# EAGLE design audio_mixer (EAGLE 9.3.0)
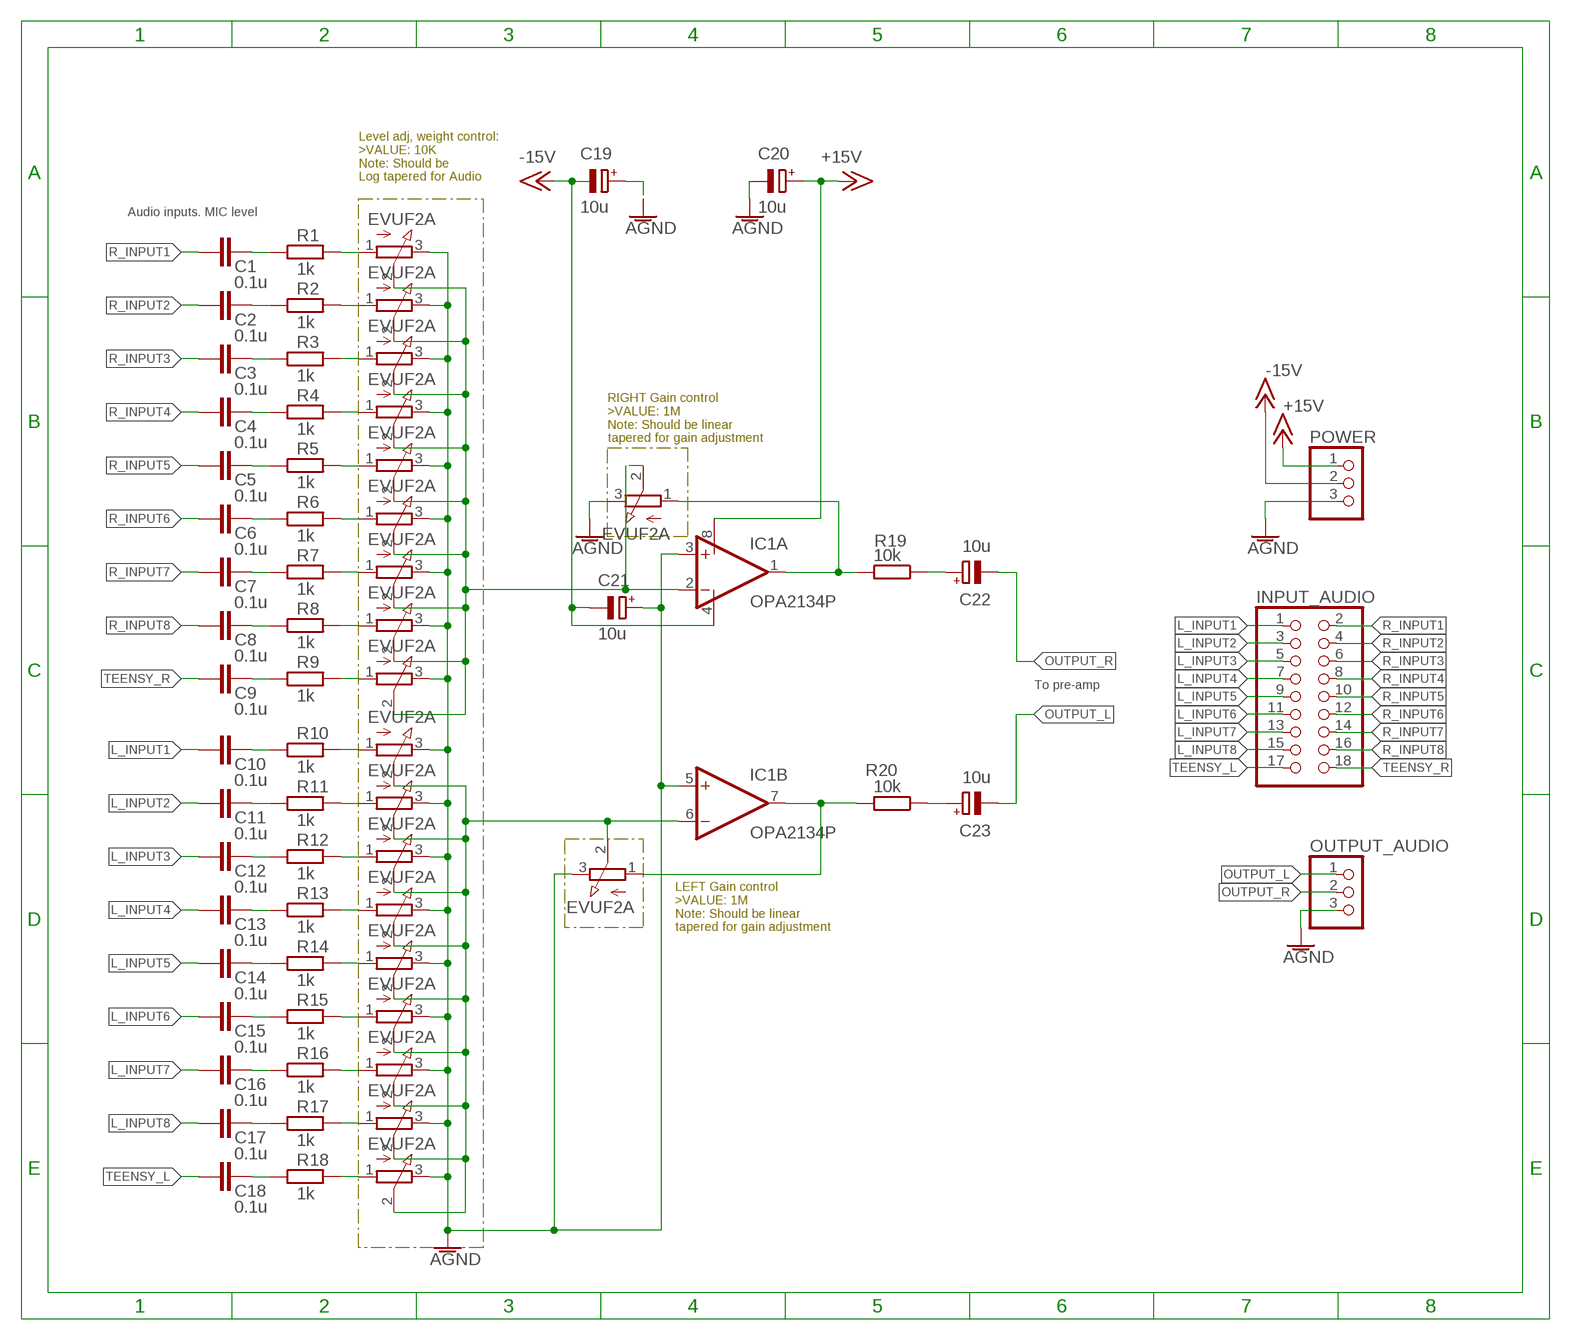
[diagram p0: schematic, sheet 1]

## Parts
C1  0.1u  C-EU025-030X050  [C025-030X050]
C2  0.1u  C-EU025-030X050  [C025-030X050]
C3  0.1u  C-EU025-030X050  [C025-030X050]
C4  0.1u  C-EU025-030X050  [C025-030X050]
C5  0.1u  C-EU025-030X050  [C025-030X050]
C6  0.1u  C-EU025-030X050  [C025-030X050]
C7  0.1u  C-EU025-030X050  [C025-030X050]
C8  0.1u  C-EU025-030X050  [C025-030X050]
C9  0.1u  C-EU025-030X050  [C025-030X050]
C10  0.1u  C-EU025-030X050  [C025-030X050]
C11  0.1u  C-EU025-030X050  [C025-030X050]
C12  0.1u  C-EU025-030X050  [C025-030X050]
C13  0.1u  C-EU025-030X050  [C025-030X050]
C14  0.1u  C-EU025-030X050  [C025-030X050]
C15  0.1u  C-EU025-030X050  [C025-030X050]
C16  0.1u  C-EU025-030X050  [C025-030X050]
C17  0.1u  C-EU025-030X050  [C025-030X050]
C18  0.1u  C-EU025-030X050  [C025-030X050]
C19  10u  CPOL-EUE5-10.5  [E5-10,5]
C20  10u  CPOL-EUE5-10.5  [E5-10,5]
C21  10u  CPOL-EUE5-10.5  [E5-10,5]
C22  10u  CPOL-EUE5-10.5  [E5-10,5]
C23  10u  CPOL-EUE5-10.5  [E5-10,5]
IC1  OPA2134P  [DIL08]
INPUT_AUDIO  PINHD-2X9  [2X09]
OUTPUT_AUDIO  PINHD-1X3  [1X03]
POWER  PINHD-1X3  [1X03]
R1  1k  R-EU_R0805  [R0805]
R2  1k  R-EU_R0805  [R0805]
R3  1k  R-EU_R0805  [R0805]
R4  1k  R-EU_R0805  [R0805]
R5  1k  R-EU_R0805  [R0805]
R6  1k  R-EU_R0805  [R0805]
R7  1k  R-EU_R0805  [R0805]
R8  1k  R-EU_R0805  [R0805]
R9  1k  R-EU_R0805  [R0805]
R10  1k  R-EU_R0805  [R0805]
R11  1k  R-EU_R0805  [R0805]
R12  1k  R-EU_R0805  [R0805]
R13  1k  R-EU_R0805  [R0805]
R14  1k  R-EU_R0805  [R0805]
R15  1k  R-EU_R0805  [R0805]
R16  1k  R-EU_R0805  [R0805]
R17  1k  R-EU_R0805  [R0805]
R18  1k  R-EU_R0805  [R0805]
R19  10k  R-EU_R0805  [R0805]
R20  10k  R-EU_R0805  [R0805]
VR1  EVUF2A  [EVUF]
VR2  EVUF2A  [EVUF]
VR3  EVUF2A  [EVUF]
VR4  EVUF2A  [EVUF]
VR5  EVUF2A  [EVUF]
VR6  EVUF2A  [EVUF]
VR7  EVUF2A  [EVUF]
VR8  EVUF2A  [EVUF]
VR9  EVUF2A  [EVUF]
VR10  EVUF2A  [EVUF]
VR11  EVUF2A  [EVUF]
VR12  EVUF2A  [EVUF]
VR13  EVUF2A  [EVUF]
VR14  EVUF2A  [EVUF]
VR15  EVUF2A  [EVUF]
VR16  EVUF2A  [EVUF]
VR17  EVUF2A  [EVUF]
VR18  EVUF2A  [EVUF]
VR19  EVUF2A  [EVUF]
VR20  EVUF2A  [EVUF]

## Nets
+15V: C20.+ IC1.8(P:V+) POWER.1
-15V: C19.- C21.- IC1.4(P:V-) POWER.2
AGND: C19.+ C20.- C21.+ IC1.3(A:+IN) IC1.5(B:+IN) OUTPUT_AUDIO.3 POWER.3 VR1.3(E) VR2.3(E) VR3.3(E) VR4.3(E) VR5.3(E) VR6.3(E) VR7.3(E) VR8.3(E) VR9.3(E) VR10.3(E) VR11.3(E) VR12.3(E) VR13.3(E) VR14.3(E) VR15.3(E) VR16.3(E) VR17.3(E) VR18.3(E) VR19.3(E) VR20.3(E)
L_INPUT1: C10.2 INPUT_AUDIO.1
L_INPUT2: C11.2 INPUT_AUDIO.3
L_INPUT3: C12.2 INPUT_AUDIO.5
L_INPUT4: C13.2 INPUT_AUDIO.7
L_INPUT5: C14.2 INPUT_AUDIO.9
L_INPUT6: C15.2 INPUT_AUDIO.11
L_INPUT7: C16.2 INPUT_AUDIO.13
L_INPUT8: C17.2 INPUT_AUDIO.15
L_OP_IN: IC1.6(B:-IN) VR10.2(S) VR11.2(S) VR12.2(S) VR13.2(S) VR14.2(S) VR15.2(S) VR16.2(S) VR17.2(S) VR18.2(S) VR20.2(S)
LEFT_OP_OUT: IC1.7(B:OUT) R20.2 VR20.1(A)
N$1: C4.1 R4.1
N$2: C22.+ R19.1
N$3: C1.1 R1.1
N$4: C2.1 R2.1
N$5: C3.1 R3.1
N$6: C9.1 R9.1
N$7: R9.2 VR9.1(A)
N$8: C10.1 R10.1
N$9: R10.2 VR10.1(A)
N$10: R3.2 VR3.1(A)
N$11: C11.1 R11.1
N$13: R1.2 VR1.1(A)
N$14: R4.2 VR4.1(A)
N$15: C12.1 R12.1
N$16: C13.1 R13.1
N$17: R13.2 VR13.1(A)
N$18: R2.2 VR2.1(A)
N$20: C23.+ R20.1
N$21: R11.2 VR11.1(A)
N$23: R12.2 VR12.1(A)
N$25: C5.1 R5.1
N$26: C6.1 R6.1
N$27: C7.1 R7.1
N$28: R7.2 VR7.1(A)
N$29: R5.2 VR5.1(A)
N$30: R6.2 VR6.1(A)
N$31: C8.1 R8.1
N$32: R8.2 VR8.1(A)
N$35: C14.1 R14.1
N$36: R14.2 VR14.1(A)
N$39: C15.1 R15.1
N$40: C16.1 R16.1
N$41: C17.1 R17.1
N$42: R17.2 VR17.1(A)
N$43: R15.2 VR15.1(A)
N$44: R16.2 VR16.1(A)
N$45: C18.1 R18.1
N$46: R18.2 VR18.1(A)
OUTPUT_L: C23.- OUTPUT_AUDIO.1
OUTPUT_R: C22.- OUTPUT_AUDIO.2
R_INPUT1: C1.2 INPUT_AUDIO.2
R_INPUT2: C2.2 INPUT_AUDIO.4
R_INPUT3: C3.2 INPUT_AUDIO.6
R_INPUT4: C4.2 INPUT_AUDIO.8
R_INPUT5: C5.2 INPUT_AUDIO.10
R_INPUT6: C6.2 INPUT_AUDIO.12
R_INPUT7: C7.2 INPUT_AUDIO.14
R_INPUT8: C8.2 INPUT_AUDIO.16
R_OP_IN: IC1.2(A:-IN) VR1.2(S) VR2.2(S) VR3.2(S) VR4.2(S) VR5.2(S) VR6.2(S) VR7.2(S) VR8.2(S) VR9.2(S) VR19.2(S)
RIGHT_OP_OUT: IC1.1(A:OUT) R19.2 VR19.1(A)
TEENSY_L: C18.2 INPUT_AUDIO.17
TEENSY_R: C9.2 INPUT_AUDIO.18

## Notes on the sheet
- Level adj, weight control:
  >VALUE: 10K
  Note: Should be
  Log tapered for Audio
- Audio inputs. MIC level
- RIGHT Gain control
  >VALUE: 1M
  Note: Should be linear
  tapered for gain adjustment
- To pre-amp
- LEFT Gain control
  >VALUE: 1M
  Note: Should be linear
  tapered for gain adjustment

## Library data of the parts
C1-C18 = rcl:C-EU: CAPACITOR, European symbol; SPICEPREFIX: C
C19-C23 = rcl:CPOL-EU: POLARIZED CAPACITOR, European symbol; SPICEPREFIX: C
IC1 = linear:OPA2134: SoundPLUS (TM) High Performance AUDIO OPERATIONAL AMPLIFIERS Source: http://focus.ti.com/lit/ds/sbos058/sbos058.pdf
INPUT_AUDIO = pinhead:PINHD-2X9: PIN HEADER
OUTPUT_AUDIO POWER = pinhead:PINHD-1X3: PIN HEADER
R1-R20 = rcl:R-EU_: RESISTOR, European symbol; SPICEPREFIX: R
VR1-VR20 = pot:EVU: 9 mm Square Rotary Potentiometers Source: Panasonic

## Board
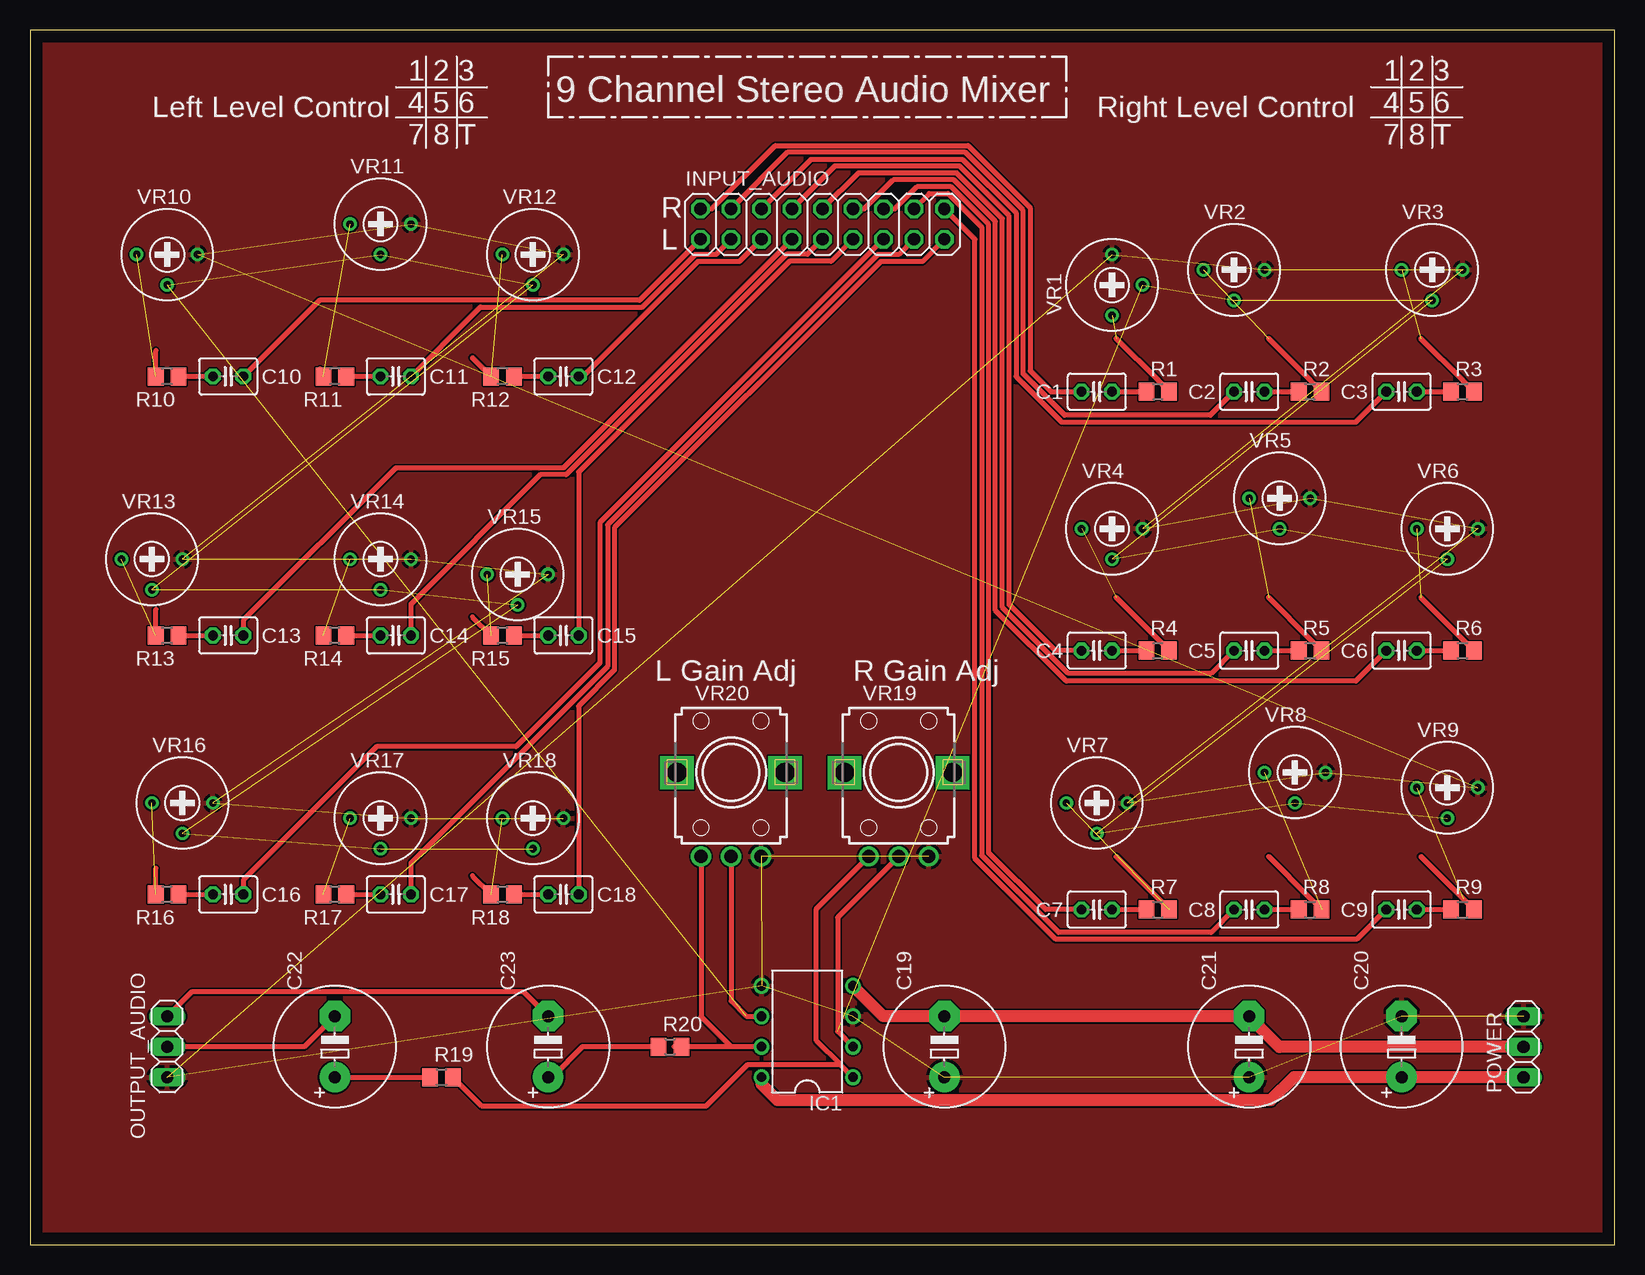
[diagram p1: board, top side]

Size 132.06 x 101.27 mm. Coordinates in mm from the lower left corner, seen from the top.
Outline: 0,0 132.06,0 132.06,101.27 0,101.27 0,0
Copper layers (1*16): Top 0.035mm / dielectric 1.5mm / Bottom 0.035mm
Design rules "default": minimum track width 6mil, minimum drill 0.35mm, track to track 6mil, track to pad 6mil, pad to pad 6mil, via to via 6mil, smd to smd 6mil, copper to edge 40mil, drill to drill 6mil, minimum pad ring 10mil, minimum via ring 8mil, stop-mask expansion 4mil, vias tented up to drill 0mil, thermal gap 10mil

### Footprints (pad centres in the part's own frame; a part is rotated, then mirrored left to right if it is on the bottom)
C025-030X050 = drill 0.813 octagon: 1 -1.27,0; 2 1.27,0
E5-10,5 = drill 1.016 pad 2.54: + -2.54,0 | drill 1.016 pad 2.54 octagon: - 2.54,0
DIL08 = drill 0.813 pad 1.27: 1 -3.81,-3.81; 2 -1.27,-3.81; 3 1.27,-3.81; 4 3.81,-3.81; 5 3.81,3.81; 6 1.27,3.81; 7 -1.27,3.81; 8 -3.81,3.81
2X09 = drill 1.016 octagon: 1 -10.16,-1.27; 2 -10.16,1.27; 3 -7.62,-1.27; 4 -7.62,1.27; 5 -5.08,-1.27; 6 -5.08,1.27; 7 -2.54,-1.27; 8 -2.54,1.27; 9 0,-1.27; 10 0,1.27; 11 2.54,-1.27; 12 2.54,1.27; 13 5.08,-1.27; 14 5.08,1.27; 15 7.62,-1.27; 16 7.62,1.27; 17 10.16,-1.27; 18 10.16,1.27
1X03 = drill 1.016 long: 1 -2.54,0; 2 0,0; 3 2.54,0
R0805 = smd 1.3 x 1.5: 1 -0.95,0; 2 0.95,0
RTRIM3339P = drill 0.61: 1 -2.54,0; 2 0,-2.54; 3 2.54,0
EVUF = drill 1.1 pad 1.676: 1 -2.5,-7; 2 0,-7; 3 2.5,-7 | drill 1.6 pad 2.8 square: M1 4.5,0; M2 -4.5,0

### Placement (x,y rotation side)
C1  88.9,71.12 180 top
C2  101.6,71.12 180 top
C3  114.3,71.12 180 top
C4  88.9,49.53 180 top
C5  101.6,49.53 180 top
C6  114.3,49.53 180 top
C7  88.9,27.94 180 top
C8  101.6,27.94 180 top
C9  114.3,27.94 180 top
C10  16.51,72.39 0 top
C11  30.48,72.39 0 top
C12  44.45,72.39 0 top
C13  16.51,50.8 0 top
C14  30.48,50.8 0 top
C15  44.45,50.8 0 top
C16  16.51,29.21 0 top
C17  30.48,29.21 0 top
C18  44.45,29.21 0 top
C19  76.2,16.51 90 top
C20  114.3,16.51 90 top
C21  101.6,16.51 90 top
C22  25.4,16.51 90 top
C23  43.18,16.51 90 top
IC1  64.77,17.78 90 top
INPUT_AUDIO  66.04,85.09 0 top
OUTPUT_AUDIO  11.43,16.51 270 top
POWER  124.46,16.51 90 top
R1  93.98,71.12 0 top
R2  106.68,71.12 0 top
R3  119.38,71.12 0 top
R4  93.98,49.53 0 top
R5  106.68,49.53 0 top
R6  119.38,49.53 0 top
R7  93.98,27.94 0 top
R8  106.68,27.94 0 top
R9  119.38,27.94 0 top
R10  11.43,72.39 180 top
R11  25.4,72.39 180 top
R12  39.37,72.39 180 top
R13  11.43,50.8 180 top
R14  25.4,50.8 180 top
R15  39.37,50.8 180 top
R16  11.43,29.21 180 top
R17  25.4,29.21 180 top
R18  39.37,29.21 180 top
R19  34.29,13.97 0 top
R20  53.34,16.51 0 top
VR1  [RTRIM3339P]  90.17,80.01 90 top
VR2  [RTRIM3339P]  100.33,81.28 0 top
VR3  [RTRIM3339P]  116.84,81.28 0 top
VR4  [RTRIM3339P]  90.17,59.69 0 top
VR5  [RTRIM3339P]  104.14,62.23 0 top
VR6  [RTRIM3339P]  118.11,59.69 0 top
VR7  [RTRIM3339P]  88.9,36.83 0 top
VR8  [RTRIM3339P]  105.41,39.37 0 top
VR9  [RTRIM3339P]  118.11,38.1 0 top
VR10  [RTRIM3339P]  11.43,82.55 0 top
VR11  [RTRIM3339P]  29.21,85.09 0 top
VR12  [RTRIM3339P]  41.91,82.55 0 top
VR13  [RTRIM3339P]  10.16,57.15 0 top
VR14  [RTRIM3339P]  29.21,57.15 0 top
VR15  [RTRIM3339P]  40.64,55.88 0 top
VR16  [RTRIM3339P]  12.7,36.83 0 top
VR17  [RTRIM3339P]  29.21,35.56 0 top
VR18  [RTRIM3339P]  41.91,35.56 0 top
VR19  72.39,39.37 0 top
VR20  58.42,39.37 0 top

### Tracks (layer width: path | path; a pad name or v marks a point on that pad's centre or on a via)
+15V
  Top 1: POWER.1 C20.+ 105.33,13.97 103.41,12.05 62.3,12.05 60.96,13.38 IC1.8
-15V
  Top 1: POWER.2 124.44,16.49 104.11,16.49 101.6,19 C21.- C19.- 71.12,19.05 IC1.4
AGND  (26 unrouted)
  pour Top: -3.81,109.22 127,109.22 arc-90 140.97,95.25 140.97,2.54 arc-90 129.54,-8.89 2.54,-8.89 arc-90 -10.16,3.81 -10.16,102.87 arc-90
L_INPUT1
  Top 0.42: INPUT_AUDIO.1 50.8,78.74 24.13,78.74 C10.2
L_INPUT2
  Top 0.42: C11.2 36.83,77.47 37.53,78.17 51.04,78.17 55.42,82.55 57.15,82.55 INPUT_AUDIO.3
L_INPUT3
  Top 0.42: INPUT_AUDIO.5 59.12,81.98 55.66,81.98 46.07,72.39 C12.2
L_INPUT4
  Top 0.42: C13.2 17.78,52.07 30.48,64.77 44.45,64.77 INPUT_AUDIO.7
L_INPUT5
  Top 0.42: C14.2 31.75,53.42 42.52,64.2 44.69,64.2 63.06,82.57 64.79,82.57 INPUT_AUDIO.9
L_INPUT6
  Top 0.42: C15.2 45.72,64.42 63.3,82 66.76,82 INPUT_AUDIO.11
L_INPUT7
  Top 0.42: C16.2 17.78,30.4 28.91,41.53 40.51,41.53 47.5,48.51 47.5,60.2 INPUT_AUDIO.13
L_INPUT8
  Top 0.42: C17.2 31.75,31.83 48.13,48.22 48.13,60.02 70.66,82.55 72.39,82.55 INPUT_AUDIO.15
L_OP_IN  (9 unrouted)
  Top 0.42: VR20.2 58.42,20.32 59.69,19.05 IC1.6
LEFT_OP_OUT
  Top 0.42: IC1.7 58.42,16.51 | 58.42,16.51 R20.2 53.66,16.51 | VR20.1 55.92,19.01 58.42,16.51
N$1
  Top 0.42: C4.1 R4.1
N$2
  Top 0.42: C22.+ R19.1
N$3
  Top 0.42: C1.1 R1.1
N$4
  Top 0.42: C2.1 R2.1
N$5
  Top 0.42: C3.1 R3.1
N$6
  Top 0.42: C9.1 R9.1
N$7  (1 unrouted)
  Top 0.42: R9.2 119.44,28.83 119.44,28.84 115.91,32.37
N$8
  Top 0.42: C10.1 R10.1
N$9  (1 unrouted)
  Top 0.42: R10.2 10.48,74.56
N$10  (1 unrouted)
  Top 0.42: R3.2 119.44,72.01 119.44,72.02 115.91,75.55
N$11
  Top 0.42: C11.1 R11.1
N$13  (1 unrouted)
  Top 0.42: R1.2 94.04,72.01 94.04,72.02 90.51,75.55
N$14  (1 unrouted)
  Top 0.42: R4.2 94.04,50.42 94.04,50.43 90.51,53.96
N$15
  Top 0.42: C12.1 R12.1
N$16
  Top 0.42: R13.1 C13.1
N$17  (1 unrouted)
  Top 0.42: R13.2 10.48,52.97
N$18  (1 unrouted)
  Top 0.42: R2.2 106.74,72.01 106.74,72.02 103.21,75.55
N$20
  Top 0.42: R20.1 46.04,16.51 43.5,13.97 C23.+
N$21  (1 unrouted)
  Top 0.42: R11.2 24.45,72.73 24.17,73.01
N$23  (1 unrouted)
  Top 0.42: R12.2 36.87,73.94
N$25
  Top 0.42: C5.1 R5.1
N$26
  Top 0.42: C6.1 R6.1
N$27
  Top 0.42: C7.1 R7.1
N$28  (1 unrouted)
  Top 0.42: R7.2 94.04,28.83 94.04,28.84 90.51,32.37
N$29  (1 unrouted)
  Top 0.42: R5.2 106.74,50.42 106.74,50.43 103.21,53.96
N$30  (1 unrouted)
  Top 0.42: R6.2 119.44,50.42 119.44,50.43 115.91,53.96
N$31
  Top 0.42: C8.1 R8.1
N$32  (1 unrouted)
  Top 0.42: R8.2 106.74,28.83 106.74,28.84 103.21,32.37
N$35
  Top 0.42: R14.1 C14.1
N$36  (1 unrouted)
  Top 0.42: 24.17,51.08 R14.2
N$39
  Top 0.42: R15.1 C15.1
N$40
  Top 0.42: R16.1 C16.1
N$41
  Top 0.42: R17.1 C17.1
N$42  (1 unrouted)
  Top 0.42: 24.17,29.49 R17.2
N$43  (1 unrouted)
  Top 0.42: 36.87,52.35 R15.2
N$44  (1 unrouted)
  Top 0.42: R16.2 10.48,31.38
N$45
  Top 0.42: R18.1 C18.1
N$46  (1 unrouted)
  Top 0.42: 36.87,30.76 R18.2
OUTPUT_L
  Top 0.42: C23.- 41.15,21.08 13.46,21.08 OUTPUT_AUDIO.1
OUTPUT_R
  Top 0.42: C22.- 22.86,16.51 OUTPUT_AUDIO.2
R_INPUT1
  Top 0.42: INPUT_AUDIO.2 56.83,86.36 62.11,91.64 78.18,91.64 83.34,86.48 83.34,72.87 85.09,71.12 C1.2
R_INPUT2
  Top 0.42: INPUT_AUDIO.4 63.12,91.06 77.94,91.06 82.77,86.24 82.77,72.61 86.22,69.15 98.36,69.15 C2.2
R_INPUT3
  Top 0.42: INPUT_AUDIO.6 65.09,90.49 77.71,90.49 82.17,86.02 82.17,72.39 85.98,68.58 110.49,68.58 C3.2
R_INPUT4
  Top 0.42: INPUT_AUDIO.8 67.06,89.92 77.47,89.92 81.6,85.79 81.6,53.37 85.44,49.53 C4.2
R_INPUT5
  Top 0.42: INPUT_AUDIO.10 69.03,89.35 77.23,89.35 81.03,85.55 81.03,53.13 86.53,47.62 98.42,47.62 C5.2
R_INPUT6
  Top 0.42: INPUT_AUDIO.12 69.53,86.36 71.94,88.78 76.99,88.78 80.46,85.31 80.46,52.89 86.36,46.99 110.49,46.99 C6.2
R_INPUT7
  Top 0.42: INPUT_AUDIO.14 72.07,86.36 73.91,88.2 76.76,88.2 79.89,85.08 79.89,32.69 84.63,27.94 C7.2
R_INPUT8
  Top 0.42: INPUT_AUDIO.16 74.93,87.63 76.52,87.63 79.31,84.84 79.31,32.45 85.72,26.04 98.42,26.04 C8.2
R_OP_IN  (9 unrouted)
  Top 0.42: VR19.2 67.31,27.29 67.31,17.78 IC1.2
RIGHT_OP_OUT
  Top 0.42: 67.56,14.99 59.77,14.99 56.33,11.56 37.67,11.56 R19.2 | IC1.1 67.56,14.99 | 67.56,14.99 65.53,17.02 65.53,28.01 VR19.1
TEENSY_L
  Top 0.42: C18.2 45.72,44.91 48.7,47.9 48.7,59.79 70.9,81.98 74.36,81.98 INPUT_AUDIO.17
TEENSY_R
  Top 0.42: C9.2 110.55,25.46 85.49,25.46 78.74,32.21 78.74,83.82 INPUT_AUDIO.18

### Text on the board
tPlace: 9 Channel Stereo Audio Mixer | Left Level Control | Right Level Control | 1 2 3 / 4 5 6 / 7 8 T | 1 2 3 / 4 5 6 / 7 8 T | R / L | L Gain Adj | R Gain Adj